# EAGLE design flukso.sensor.board.v2.1 (EAGLE 5.04)
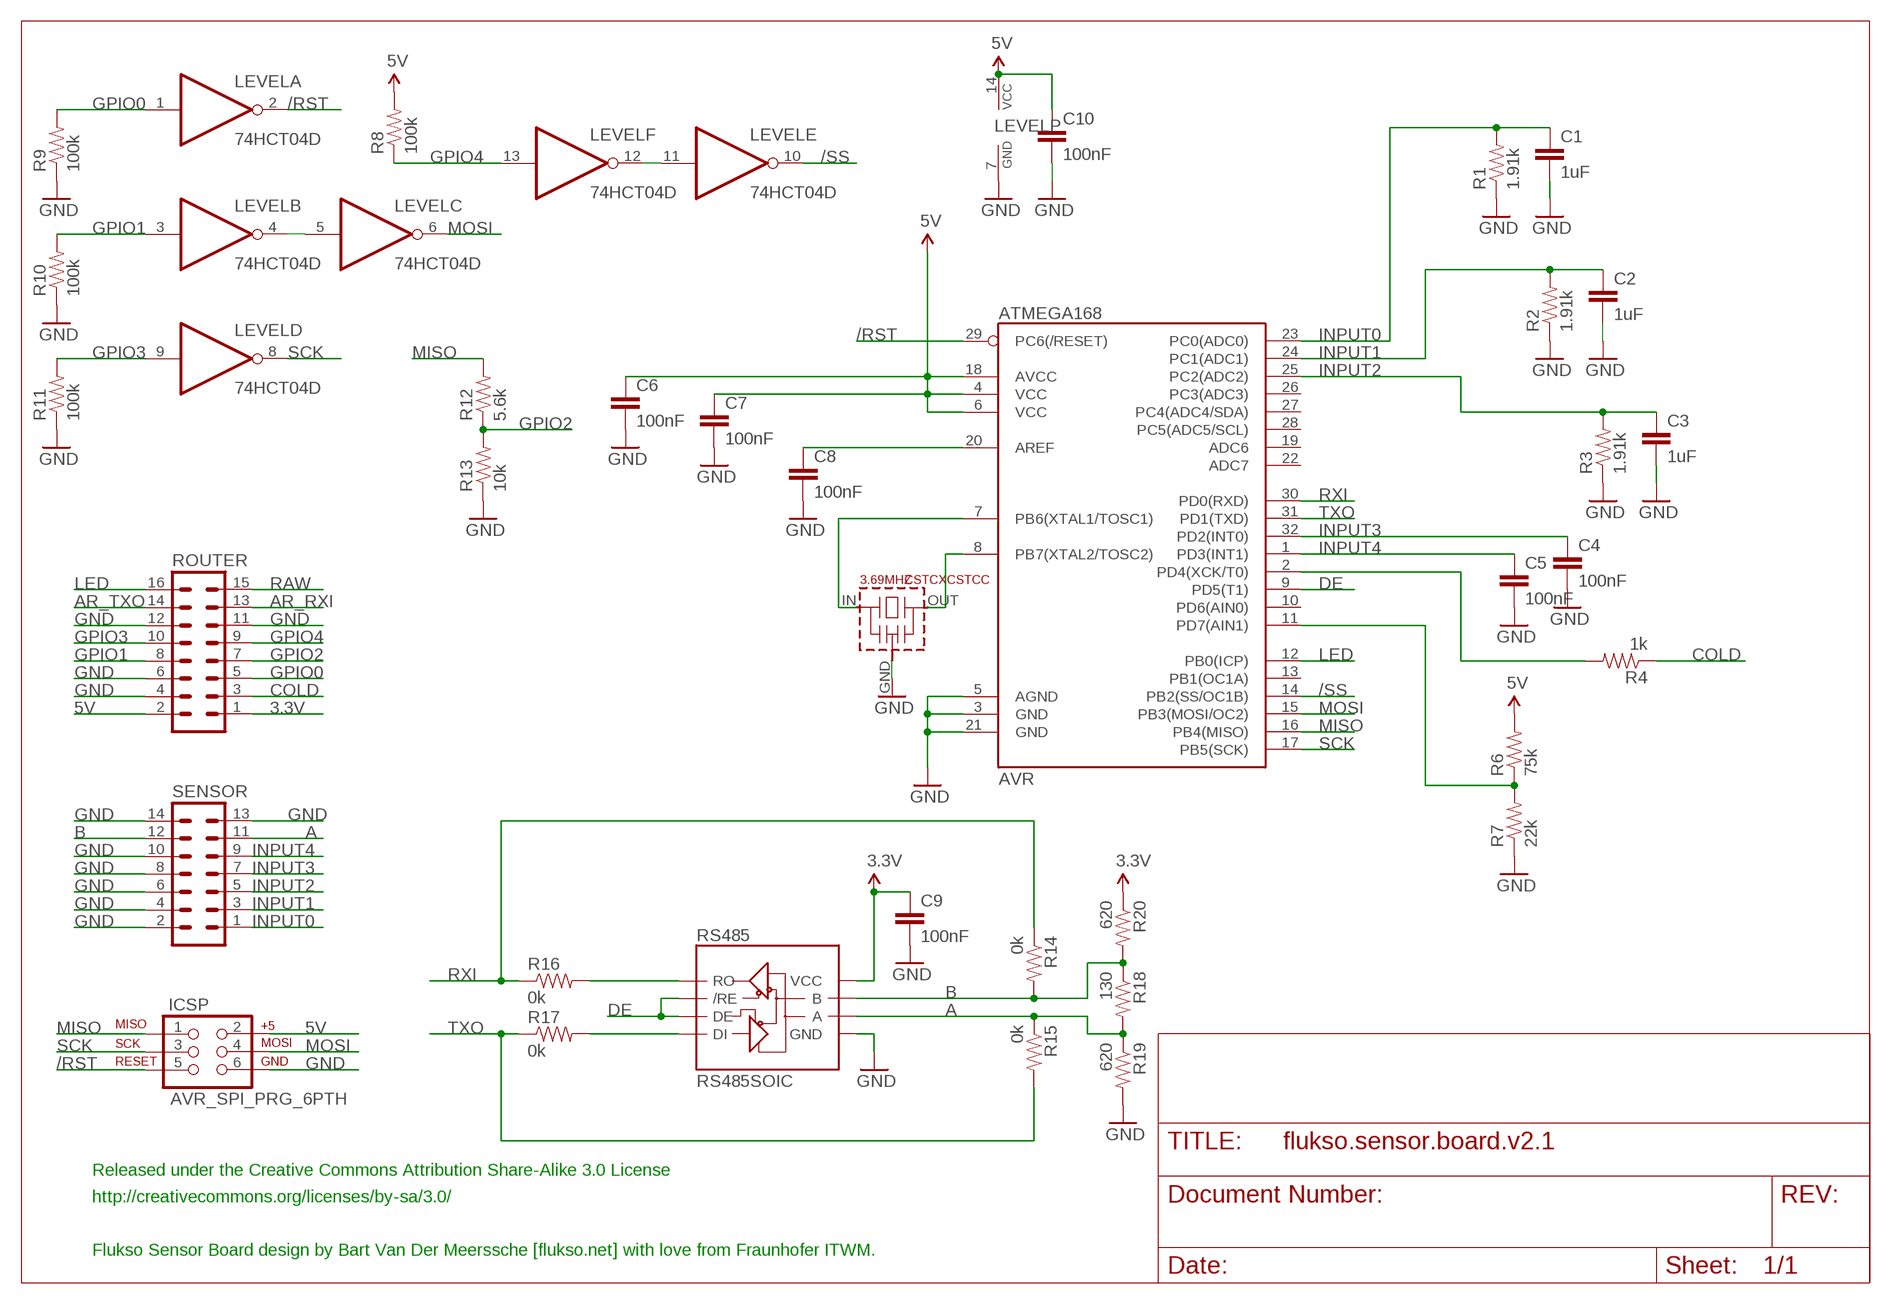
[diagram p0: schematic, sheet 1]

## Parts
3.69MHZ  CSTCXCSTCC  [CSTCC]
AVR  ATMEGA168  [TQFP32-08]
C1  1uF  CAP0402-CAP  [0402-CAP]
C2  1uF  CAP0402-CAP  [0402-CAP]
C3  1uF  CAP0402-CAP  [0402-CAP]
C4  100nF  CAP0402-CAP  [0402-CAP]
C5  100nF  CAP0402-CAP  [0402-CAP]
C6  100nF  CAP0402-CAP  [0402-CAP]
C7  100nF  CAP0402-CAP  [0402-CAP]
C8  100nF  CAP0402-CAP  [0402-CAP]
C9  100nF  CAP0402-CAP  [0402-CAP]
C10  100nF  CAP0402-CAP  [0402-CAP]
ICSP  AVR_SPI_PRG_6PTH  [2X3]
LEVEL  74HCT04D  [SO14]
R1  1.91k  RESISTOR0402-RES  [0402-RES]
R2  1.91k  RESISTOR0402-RES  [0402-RES]
R3  1.91k  RESISTOR0402-RES  [0402-RES]
R4  1k  RESISTOR0402-RES  [0402-RES]
R6  75k  RESISTOR0402-RES  [0402-RES]
R7  22k  RESISTOR0402-RES  [0402-RES]
R8  100k  RESISTOR0402-RES  [0402-RES]
R9  100k  RESISTOR0402-RES  [0402-RES]
R10  100k  RESISTOR0402-RES  [0402-RES]
R11  100k  RESISTOR0402-RES  [0402-RES]
R12  5.6k  RESISTOR0402-RES  [0402-RES]
R13  10k  RESISTOR0402-RES  [0402-RES]
R14  0k  RESISTOR0402-RES  [0402-RES]
R15  0k  RESISTOR0402-RES  [0402-RES]
R16  0k  RESISTOR0402-RES  [0402-RES]
R17  0k  RESISTOR0402-RES  [0402-RES]
R18  130  RESISTOR0402-RES  [0402-RES]
R19  620  RESISTOR0402-RES  [0402-RES]
R20  620  RESISTOR0402-RES  [0402-RES]
ROUTER  MA08-2  [MA08-2]
RS485  RS485SOIC  [SO08]
SENSOR  MA07-2  [MA07-2]

## Nets
3.3V: C9.1 R20.1 ROUTER.1 RS485.8(VCC)
5V: AVR.4(VCC) AVR.6(VCC) AVR.18(AVCC) C6.1 C7.1 C10.1 ICSP.2 LEVEL.14(P:VCC) R6.2 R8.2 ROUTER.2
/RST: AVR.29(PC6(/RESET)) ICSP.5 LEVEL.2(A:O)
/SS: AVR.14(PB2(SS/OC1B)) LEVEL.10(E:O)
A: R15.1 R18.2 R19.1 RS485.6(A) SENSOR.11
AR_RXI: ROUTER.13
AR_TXO: ROUTER.14
B: R14.2 R18.1 R20.2 RS485.7(B) SENSOR.12
COLD: R4.1 ROUTER.3
DE: AVR.9(PD5(T1)) RS485.2(/RE) RS485.3(DE)
GND: 3.69MHZ.GND(VSS) AVR.3(GND) AVR.5(AGND) AVR.21(GND) C1.2 C2.2 C3.2 C4.2 C5.2 C6.2 C7.2 C8.2 C9.2 C10.2 ICSP.6 LEVEL.7(P:GND) R1.1 R2.1 R3.1 R7.1 R9.1 R10.1 R11.1 R13.1 R19.2 ROUTER.4 ROUTER.6 ROUTER.11 ROUTER.12 RS485.5(GND) SENSOR.2 SENSOR.4 SENSOR.6 SENSOR.8 SENSOR.10 SENSOR.13 SENSOR.14
GPIO0: LEVEL.1(A:I) R9.2 ROUTER.5
GPIO1: LEVEL.3(B:I) R10.2 ROUTER.8
GPIO2: R12.1 R13.2 ROUTER.7
GPIO3: LEVEL.9(D:I) R11.2 ROUTER.10
GPIO4: LEVEL.13(F:I) R8.1 ROUTER.9
INPUT0: AVR.23(PC0(ADC0)) C1.1 R1.2 SENSOR.1
INPUT1: AVR.24(PC1(ADC1)) C2.1 R2.2 SENSOR.3
INPUT2: AVR.25(PC2(ADC2)) C3.1 R3.2 SENSOR.5
INPUT3: AVR.32(PD2(INT0)) C4.1 SENSOR.7
INPUT4: AVR.1(PD3(INT1)) C5.1 SENSOR.9
LED: AVR.12(PB0(ICP)) ROUTER.16
MISO: AVR.16(PB4(MISO)) ICSP.1 R12.2
MOSI: AVR.15(PB3(MOSI/OC2)) ICSP.4 LEVEL.6(C:O)
N$1: AVR.11(PD7(AIN1)) R6.1 R7.2
N$3: 3.69MHZ.IN AVR.7(PB6(XTAL1/TOSC1))
N$4: 3.69MHZ.OUT AVR.8(PB7(XTAL2/TOSC2))
N$5: AVR.20(AREF) C8.1
N$6: R16.2 RS485.1(RO)
N$7: AVR.2(PD4(XCK/T0)) R4.2
N$8: R17.2 RS485.4(DI)
N$10: LEVEL.11(E:I) LEVEL.12(F:O)
N$28: LEVEL.4(B:O) LEVEL.5(C:I)
RAW: ROUTER.15
RXI: AVR.30(PD0(RXD)) R14.1 R16.1
SCK: AVR.17(PB5(SCK)) ICSP.3 LEVEL.8(D:O)
TXO: AVR.31(PD1(TXD)) R15.2 R17.1
Unconnected: AVR.10(PD6(AIN0)) AVR.13(PB1(OC1A)) AVR.19(ADC6) AVR.22(ADC7) AVR.26(PC3(ADC3)) AVR.27(PC4(ADC4/SDA)) AVR.28(PC5(ADC5/SCL))

## Notes on the sheet
- Released under the Creative Commons Attribution Share-Alike 3.0 License
- http://creativecommons.org/licenses/by-sa/3.0/
- Flukso Sensor Board design by Bart Van Der Meerssche [flukso.net] with love from Fraunhofer ITWM.

## Library data of the parts
3.69MHZ = murata-cstcc-cstcv-resonators:CSTCX
AVR = sparkFun:ATMEGA168
C1-C10 = sparkFun:CAP: Capacitor Standard 0603 ceramic capacitor, and 0.1" leaded capacitor.
ICSP = sparkFun:AVR_SPI_PRG_6: AVR ISP 6 Pin This is the reduced ISP connector for AVR programming. Common on Arduino. This footprint will take up less PCB space and can be used with a 10-pin to 6-pin adapter such as SKU: BOB-08508
LEVEL = 74xx-eu:74*04: Hex INVERTER
R1-R4 R6-R20 = sparkFun:RESISTOR: Resistor Basic schematic elements and footprints for 0603, 1206, and PTH 1/10th watt (small) resistors.
ROUTER = con-lstb:MA08-2: PIN HEADER
RS485 = sparkFun:RS485
SENSOR = con-lstb:MA07-2: PIN HEADER

## Board
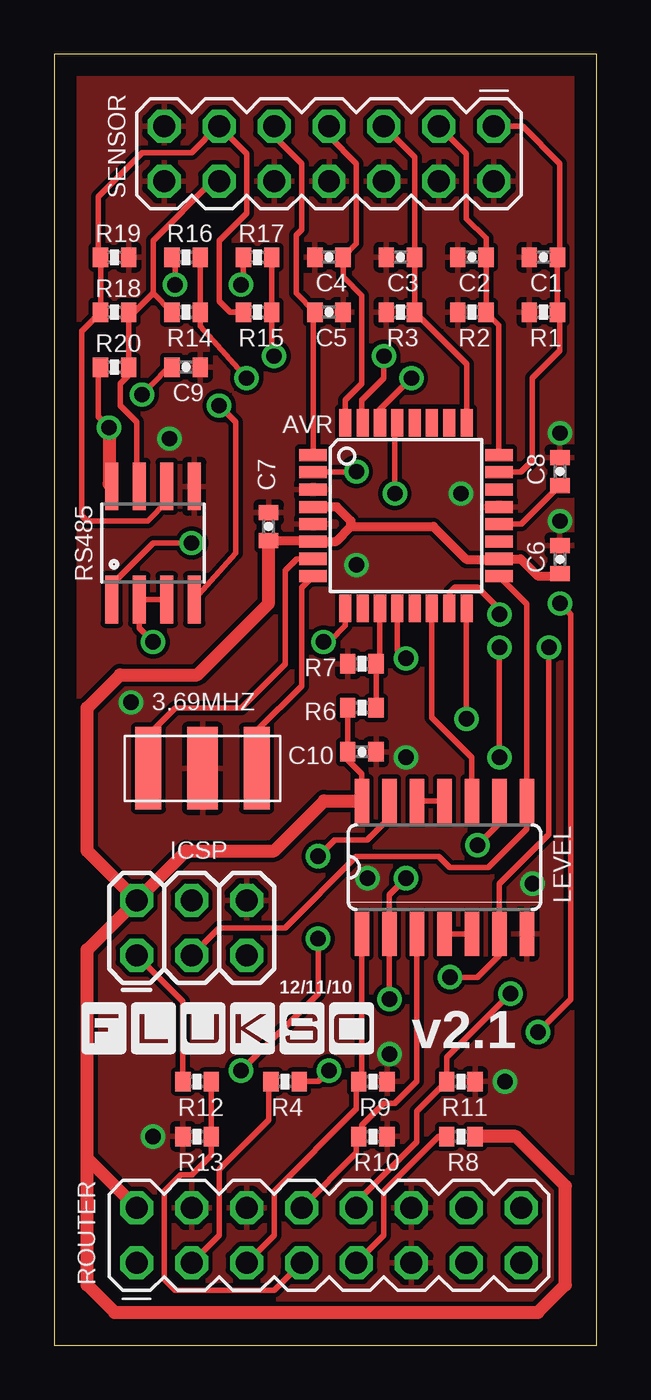
[diagram p1: board, top side]
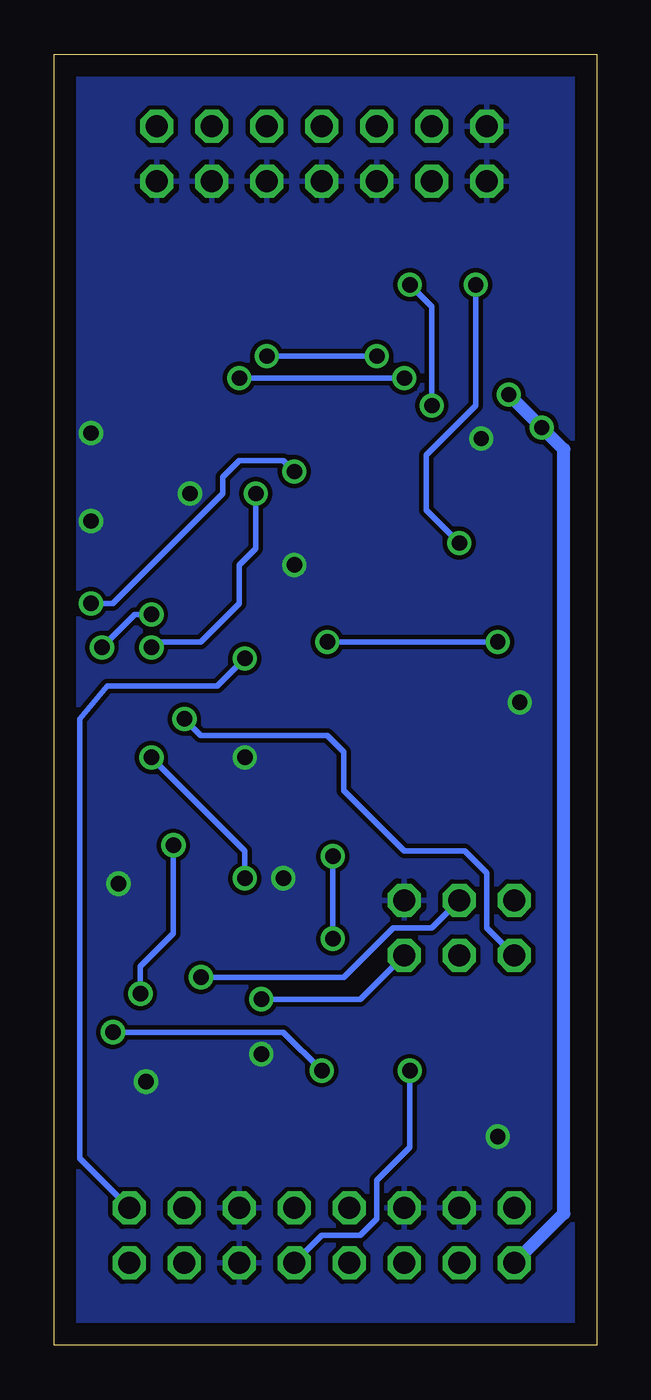
[diagram p2: board, bottom side, seen from below]

Size 25.07 x 59.68 mm. Coordinates in mm from the lower left corner, seen from the top.
Outline: 0,0 25.07,0 25.07,59.68 0,59.68 0,0
Copper layers (1*16): Top 0.035mm / dielectric 1.5mm / Bottom 0.035mm
Design rules "olimex.8mil": minimum track width 8mil, minimum drill 0.6mm, track to track 8mil, track to pad 8mil, pad to pad 8mil, via to via 8mil, smd to smd 8mil, copper to edge 40mil, drill to drill 10mil, minimum pad ring 10mil, minimum via ring 8mil, stop-mask expansion 0mil, vias tented up to drill 0mil, thermal gap 10mil

### Footprints (pad centres in the part's own frame; a part is rotated, then mirrored left to right if it is on the bottom)
CSTCC = smd 1.4 x 3.8: GND 0,0 | smd 1.2 x 3.8: IN 2.5,0; OUT -2.5,0
TQFP32-08 = smd 1.27 x 0.559: 1 -4.293,2.8; 2 -4.293,2; 3 -4.293,1.2; 4 -4.293,0.4; 5 -4.293,-0.4; 6 -4.293,-1.2; 7 -4.293,-2; 8 -4.293,-2.8; 17 4.293,-2.8; 18 4.293,-2; 19 4.293,-1.2; 20 4.293,-0.4; 21 4.293,0.4; 22 4.293,1.2; 23 4.293,2; 24 4.293,2.8 | smd 0.559 x 1.27: 9 -2.8,-4.293; 10 -2,-4.293; 11 -1.2,-4.293; 12 -0.4,-4.293; 13 0.4,-4.293; 14 1.2,-4.293; 15 2,-4.293; 16 2.8,-4.293; 25 2.8,4.293; 26 2,4.293; 27 1.2,4.293; 28 0.4,4.293; 29 -0.4,4.293; 30 -1.2,4.293; 31 -2,4.293; 32 -2.8,4.293
0402-CAP = smd 0.7 x 0.9: 1 -0.65,0; 2 0.65,0
2X3 = drill 1.016 octagon: 1 0,0; 2 0,2.54; 3 2.54,0; 4 2.54,2.54; 5 5.08,0; 6 5.08,2.54
SO14 = smd 0.66 x 2.032: 1 -3.81,-3.073; 2 -2.54,-3.073; 3 -1.27,-3.073; 4 0,-3.073; 5 1.27,-3.073; 6 2.54,-3.073; 7 3.81,-3.073; 8 3.81,3.073; 9 2.54,3.073; 10 1.27,3.073; 11 0,3.073; 12 -1.27,3.073; 13 -2.54,3.073; 14 -3.81,3.073
0402-RES = smd 0.7 x 0.9: 1 -0.65,0; 2 0.65,0
MA08-2 = drill 1.016 octagon: 1 -8.89,-1.27; 2 -8.89,1.27; 3 -6.35,-1.27; 4 -6.35,1.27; 5 -3.81,-1.27; 6 -3.81,1.27; 7 -1.27,-1.27; 8 -1.27,1.27; 9 1.27,-1.27; 10 1.27,1.27; 11 3.81,-1.27; 12 3.81,1.27; 13 6.35,-1.27; 14 6.35,1.27; 15 8.89,-1.27; 16 8.89,1.27
SO08 = smd 0.61 x 2.21: 1 -1.905,-2.616; 2 -0.635,-2.616; 3 0.635,-2.616; 4 1.905,-2.616; 5 1.905,2.616; 6 0.635,2.616; 7 -0.635,2.616; 8 -1.905,2.616
MA07-2 = drill 1.016 octagon: 1 -7.62,-1.27; 2 -7.62,1.27; 3 -5.08,-1.27; 4 -5.08,1.27; 5 -2.54,-1.27; 6 -2.54,1.27; 7 0,-1.27; 8 0,1.27; 9 2.54,-1.27; 10 2.54,1.27; 11 5.08,-1.27; 12 5.08,1.27; 13 7.62,-1.27; 14 7.62,1.27

### Placement (x,y rotation side)
3.69MHZ  6.86,26.67 180 top
AVR  16.26,38.35 0 top
C1  22.61,50.29 180 top
C2  19.3,50.29 180 top
C3  16,50.29 180 top
C4  12.7,50.29 180 top
C5  12.7,47.75 0 top
C6  23.37,36.32 90 top
C7  9.91,37.85 90 top
C8  23.37,40.39 90 top
C9  6.1,45.21 0 top
C10  14.22,27.43 0 top
ICSP  3.81,18.03 0 top
LEVEL  18.03,22.1 0 top
R1  22.61,47.75 0 top
R2  19.3,47.75 0 top
R3  16,47.75 0 top
R4  10.67,12.19 0 top
R6  14.22,29.46 180 top
R7  14.22,31.5 0 top
R8  18.8,9.65 0 top
R9  14.73,12.19 180 top
R10  14.73,9.65 180 top
R11  18.8,12.19 180 top
R12  6.6,12.19 180 top
R13  6.6,9.65 0 top
R14  6.1,47.75 180 top
R15  9.4,47.75 0 top
R16  6.1,50.29 180 top
R17  9.4,50.29 180 top
R18  2.79,47.75 180 top
R19  2.79,50.29 0 top
R20  2.79,45.21 0 top
ROUTER  12.7,5.08 0 top
RS485  4.57,37.08 0 top
SENSOR  12.7,55.07 180 top
U$4  [FLUKSO_LOGO_MEDIUM]  1.27,13.46 0 top

### Tracks (layer width: path | path; a pad name or v marks a point on that pad's centre or on a via)
3.3V  (via drill 0.71 pad 0.61)
  Top 0.254: R20.1 2.03,45.1 2.03,42.93 v2.54,42.42 | C9.1 5.19,45.1 v4.06,43.94
  Top 0.61: v2.54,42.42 2.54,39.83 RS485.8
  Bottom 0.61: ROUTER.1 1.52,6.1 1.52,41.4 v2.54,42.42 v4.06,43.94
5V
  Top 0.254: R6.2 C10.1 13.57,27.07 14.22,26.42 LEVEL.14
  Top 0.406: 13.72,37.85 13.02,37.15 AVR.6 11.92,37.2 C7.1 | 13.72,37.85 13.72,38.1 13.06,38.75 AVR.4 | 13.72,37.85 17.53,37.85 19.05,36.32 20.52,36.32 AVR.18 21.56,36.35 22.35,35.56 23.26,35.56 C6.1
  Top 0.61: 1.52,8.64 ROUTER.2 | 1.52,8.64 1.52,18.29 ICSP.2 | 1.52,8.64 1.52,2.79 2.79,1.52 22.35,1.52 23.62,2.79 23.62,7.37 21.34,9.65 R8.2 | LEVEL.14 12.47,25.17 10.16,22.86 6.1,22.86 ICSP.2 | C7.1 9.91,34.29 6.6,30.99 3.05,30.99 1.52,29.46 1.52,22.86 ICSP.2
/RST  (via drill 0.71 pad 0.61)
  Top 0.254: v15.75,39.37 15.75,42.54 AVR.29 | v20.57,27.18 v20.57,32.26 | v16.26,21.59 15.49,20.83 LEVEL.2 v15.49,16
  Bottom 0.254: v16.26,21.59 16.26,22.86 v20.57,27.18 | v20.57,32.26 20.32,32.51 18.29,32.51 16.51,34.29 16.51,36.07 15.75,36.83 v15.75,39.37 | ICSP.5 10.92,16 v15.49,16
/SS
  Top 0.254: AVR.14 17.46,29.03 19.3,27.18 LEVEL.10
A
  Top 0.254: R15.1 8.13,47.75 7.62,48.26 7.62,51.05 8.89,52.32 8.89,55.07 SENSOR.11 7.57,56.34 6.35,55.12 4.06,55.12 2.03,53.09 2.03,50.4 R19.1 R18.2 1.27,46.88 1.27,38.35 1.52,38.1 4.32,38.1 5.21,38.99 RS485.6
B
  Top 0.254: SENSOR.12 7.32,53.8 4.57,51.05 4.57,48.63 | 4.57,48.63 R14.2 | 4.57,48.63 3.7,47.75 R18.1 R20.2 3.44,44.85 3.05,44.45 3.05,43.43 3.81,42.67 3.81,39.83 RS485.7
COLD
  Top 0.254: 9.91,12.19 R4.1 9.91,12.08 9.91,10.41 7.62,8.13 7.62,5.08 ROUTER.3
DE  (via drill 0.71 pad 0.61)
  Top 0.254: v4.57,32.51 3.94,33.15 RS485.2 RS485.3 | v12.45,32.51 12.7,32.51 13.46,33.27 AVR.9
  Bottom 0.254: v4.57,32.51 v12.45,32.51
GND  (via drill 0.71 pad 0.61)
  other vias: 18.8,39.37 23.37,38.1 23.37,42.16 13.97,36.07 4.57,9.65 16.26,27.18 22.1,21.34 3.56,29.72 20.83,12.19 5.33,41.91 15.49,13.46 14.48,21.59
  pour Bottom: 0,59.69 25.4,59.69 25.4,0 0,0
  pour Top: 0,59.69 25.4,59.69 25.4,0 0,0
GPIO0
  Top 0.254: ROUTER.5 10.16,5.08 10.16,7.11 13.97,10.92 13.97,12.08 R9.2 14.22,12.33 LEVEL.1
GPIO1
  Top 0.254: ROUTER.8 13.97,8.89 13.97,9.54 R10.2 | LEVEL.3 16.76,12.19 15.75,11.18 15.24,11.18 14.22,10.16 14.22,9.79 R10.2 | R10.2 14.22,9.65
GPIO2
  Top 0.254: R12.1 R13.2 7.25,8.78 6.35,7.87 5.84,7.87 5.08,7.11 5.08,3.05 5.59,2.54 10.16,2.54 ROUTER.7
GPIO3  (via drill 0.71 pad 0.61)
  Top 0.254: R11.2 16.76,10.81 16.76,9.4 13.97,6.6 ROUTER.10 | v19.56,23.11 20.57,24.13 LEVEL.9 | R11.2 18.29,12.33 | R11.2 18.15,13.32 v21.08,16.26
  Bottom 0.254: v19.56,23.11 19.56,19.05 21.08,17.53 v21.08,16.26
GPIO4  (via drill 0.71 pad 0.61)
  Top 0.254: ROUTER.9 15.24,5.08 15.24,7.11 17.78,9.65 R8.1 | v12.19,22.61 12.95,23.37 14.48,23.37 15.49,24.38 LEVEL.13 | v12.19,18.8 12.19,16.26 v8.64,12.7
  Bottom 0.254: v12.19,18.8 v12.19,22.61 | ROUTER.9 12.7,5.08 10.92,5.08 10.16,5.84 10.16,7.62 8.64,9.14 v8.64,12.7
INPUT0
  Top 0.254: SENSOR.1 21.64,56.34 23.37,54.61 23.37,50.4 C1.1 R1.2 23.37,47.64 23.37,45.97 22.1,44.7 22.1,40.89 21.56,40.35 AVR.23
INPUT1
  Top 0.254: 20.57,41.18 AVR.24 20.55,47.16 R2.2 C2.1 19.95,51.17 19.05,52.07 19.05,55.07 SENSOR.3
INPUT2
  Top 0.254: AVR.25 19.06,45.35 R3.2 C3.1 16.65,54.92 SENSOR.5
INPUT3
  Top 0.254: SENSOR.7 12.7,55.88 13.97,54.61 13.97,50.91 C4.1 13.35,49.39 14.22,48.51 14.22,44.45 13.46,43.69 AVR.32
INPUT4
  Top 0.254: SENSOR.9 10.16,55.88 11.43,54.61 11.43,51.56 11.18,51.31 11.18,48.63 C5.1 11.96,47.66 AVR.1
LED  (via drill 0.71 pad 0.61)
  Top 0.254: v16.26,31.75 15.86,32.15 AVR.12
  Bottom 0.254: v16.26,31.75 17.53,30.48 22.61,30.48 23.88,28.96 23.88,8.64 ROUTER.16
MISO  (via drill 0.71 pad 0.61)
  Top 0.254: v19.05,28.96 AVR.16 | ICSP.1 5.95,15.89 R12.2
  Bottom 0.254: v19.05,28.96 18.29,28.19 12.45,28.19 11.68,27.43 11.68,25.65 8.89,22.86 6.1,22.86 5.08,21.84 5.08,19.3 ICSP.1
MOSI  (via drill 0.71 pad 0.61)
  Top 0.254: v22.86,32.26 22.86,23.62 20.57,21.34 LEVEL.6 20.57,18.03 19.56,17.02 v18.29,17.02 | AVR.15 18.29,34.09 18.29,34.8 18.54,35.05 19.56,35.05 20.57,34.04 v20.57,33.78
  Bottom 0.254: ICSP.4 7.62,19.3 9.4,19.3 11.68,17.02 v18.29,17.02 | v22.86,32.26 21.34,33.78 v20.57,33.78
N$1
  Top 0.254: R6.1 R7.2 15.06,31.42 AVR.11
N$3
  Top 0.254: 11.93,36.32 AVR.7 11.21,36.35 10.67,35.81 10.67,31.5 8.64,29.46 5.59,29.46 4.57,28.45 4.57,26.88 3.69MHZ.IN
N$4
  Top 0.254: 3.69MHZ.OUT 9.36,28.41 11.43,30.48 11.43,35.02 AVR.8
N$5
  Top 0.254: C8.1 21.59,37.95 AVR.20
N$6  (via drill 0.71 pad 0.61)
  Top 0.254: R16.2 5.59,50.29 v5.59,49.02 | RS485.1 2.79,34.59 2.79,35.31 4.57,37.08 v6.35,37.08
  Bottom 0.254: v5.59,49.02 5.59,43.43 7.87,41.15 7.87,38.61 v6.35,37.08
N$7  (via drill 0.71 pad 0.61)
  Top 0.254: v13.97,40.39 13.94,40.35 AVR.2 | v23.37,34.29 23.88,33.78 23.88,16 v22.35,14.48 | v12.7,12.7 12.19,12.19 R4.2
  Bottom 0.254: v12.7,12.7 14.48,14.48 v22.35,14.48 | v13.97,40.39 14.48,40.89 16.51,40.89 17.27,40.13 17.27,39.37 22.35,34.29 v23.37,34.29
N$8  (via drill 0.71 pad 0.61)
  Top 0.254: R17.2 8.75,49.13 v8.64,49.02 | RS485.4 8.38,36.63 8.38,42.67 v7.62,43.43
  Bottom 0.254: v8.64,49.02 7.62,48.01 v7.62,43.43
N$10
  Top 0.254: LEVEL.12 LEVEL.11
N$28
  Top 0.254: LEVEL.5 LEVEL.4
RXI  (via drill 0.71 pad 0.61)
  Top 0.254: R16.1 R14.1 6.75,47.1 v8.89,44.7 | v16.51,44.7 14.99,43.18 14.99,42.72 AVR.30
  Bottom 0.254: v8.89,44.7 v16.51,44.7
SCK
  Top 0.254: AVR.17 21.84,34.26 LEVEL.8 21.84,23.88 20.07,22.1 18.29,22.1 17.78,22.61 13.97,22.61 10.67,19.3 7.62,19.3 ICSP.3
TXO  (via drill 0.71 pad 0.61)
  Top 0.254: R17.1 R15.2 10.05,45.83 v10.16,45.72 | v15.24,45.72 15.24,44.7 14.22,43.69 14.22,42.68 AVR.31
  Bottom 0.254: v10.16,45.72 v15.24,45.72

### Text on the board
tPlace: 12/11/10 | v2.1